# Altium project SC945D.PrjPcb (part 2 of 2)

## Sheet SC945D_SD_Card.SchDoc: SD Card
size 393 x 270 mm; CompanyName: Seccom; Address1: 521, rue du capt. François Garbit; Address2: 69440 Mornant; Address3: seccom@seccom.fr; Address4: www.seccom.fr; DocumentNumber: 5; SheetNumber: 5; SheetTotal: 9; PageSetup: Record=PageOptions|CenterHorizontal=True|CenterVertical=True|PrintScale=0.74|XCorrection=1.00|YCorrection=1.00|PrintKind=0|BorderSize=5000000|LeftOffset=0|BottomOffset=0|Orientation=2|PaperLength=1000|PaperWidth=1000|Scale=100|PaperSource=7|PrintQuality=-4|MediaType=1|DitherType=10|PaperKind=A4|PrintScaleMode=1
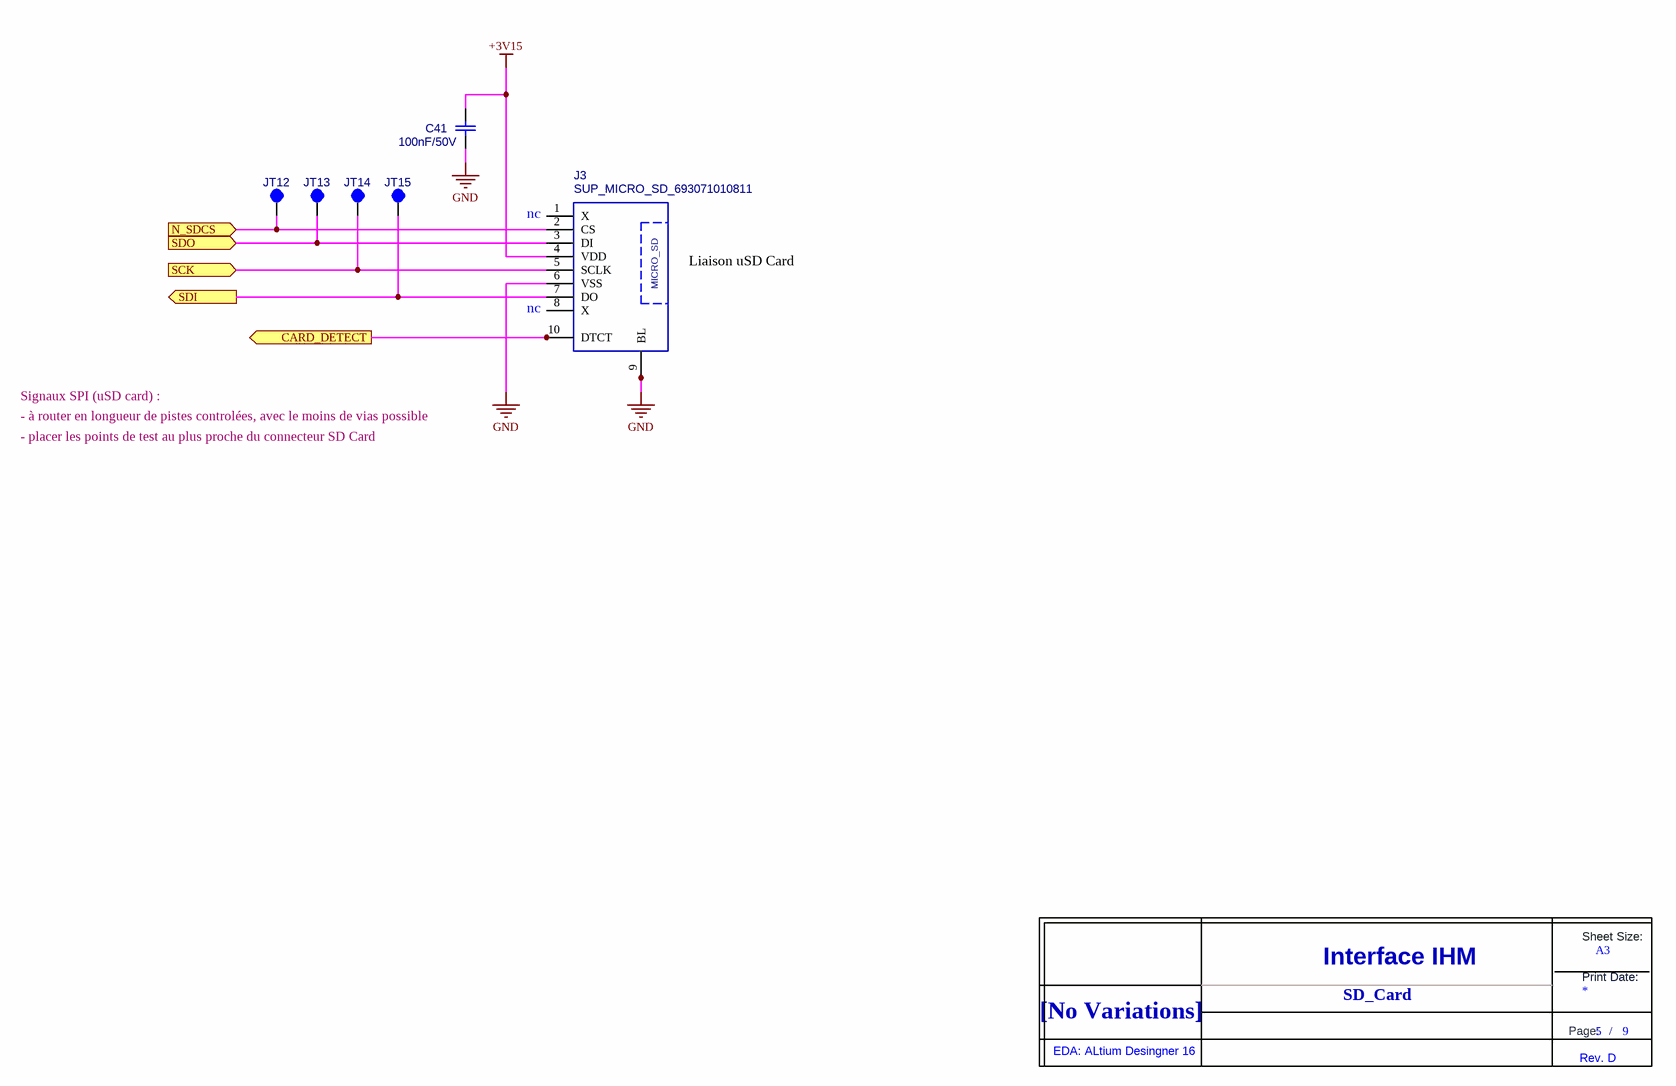
[diagram p4: SC945D_SD_Card.SchDoc]

### Parts
(Parts that share a designator on the sheet are numbered #1, #2 ... from top to bottom, then left to right.)
C41  value 100nF/50V  [0603_ReflowSoldering_CAP]  (hidden comment: C_0603_X7R_10%_100N-50V)
J3  value SUP_MICRO_SD_693071010811  [SUP_MICRO_SD_BL_PUSH-PUSH_693071010811+USD]  (hidden comment: SUP_MICRO_SD_CARD_BL_PUSH-PUSH_693071010811)
JT12  PAD_CMS_20X20_E  [PAD_CMS_20X20_E]  (value not drawn)  (no BOM)
JT13  PAD_CMS_20X20_E  [PAD_CMS_20X20_E]  (value not drawn)  (no BOM)
JT14  PAD_CMS_20X20_E  [PAD_CMS_20X20_E]  (value not drawn)  (no BOM)
JT15  PAD_CMS_20X20_E  [PAD_CMS_20X20_E]  (value not drawn)  (no BOM)
Title_new?#5  DNI  (value not drawn)  (graphical)

### Ports
CARD_DETECT (out), N_SDCS (in), SCK (in), SDI (out), SDO (in)

### Nets
+3V15: C41.2 J3.4(VDD)
GND: C41.1 J3.6(VSS) J3.9(BL) J3.9A(BL)
CARD_DETECT: J3.10(DTCT) J3.10A(DTCT) ; port CARD_DETECT
N_SDCS: J3.2(CS) JT12.1 ; port N_SDCS
SCK: J3.5(SCLK) JT14.1 ; port SCK
SDI: J3.7(DO) JT15.1 ; port SDI
SDO: J3.3(DI) JT13.1 ; port SDO

Not connected (* = marked no-connect by the designer): J3 1(X) 8(X)

### Notes on the sheet
- (near J3) nc
- (near J3) Liaison uSD Card
- - placer les points de test au plus proche du connecteur SD Card
- Signaux SPI (uSD card) :
- - à router en longueur de pistes controlées, avec le moins de vias possible
- SD_Card
- (in symbol SUP_MICRO_SD_CARD_BL_PUSH-PUSH_693071010811) MICRO_SD
- (in symbol Title_new) Sheet Size:; A3; Interface IHM; Print Date:; [No Variations]; Page:; /; EDA: ALtium Desingner 16; Rev. D

### Library data of the parts
C41 = C_0603_X7R_10%_100N-50V: as C21 on sheet SC945D_Interface_BP_et_Prog; ComponentLink1URL: O:\_Documentation\Datasheets\Kemet\Condos_Ceramic_CMS.pdf; ComponentLink2URL: o:\_Documentation\Datasheets\_BOITIERS\PASSIF_CMS\; Config: *; ComponentLink1Description: Datasheet; ComponentLink2Description: Datasheet Boitier; Supplier 1: Farnell; Supplier Part Number 1: 1288255
J3 = SUP_MICRO_SD_CARD_BL_PUSH-PUSH_693071010811: Embase pour Micro SD Card, 8 points, blindée, fixation Push-Push, noir, -25/+85°C, CMS; Creation: FB (05/03/12); Boitier: 14x15.2+1.7mm_h1.98mm; Fabricant: Wurth Elektronik; Coeff: 1; Ref Fab: 693071010811; ComponentLink2URL: o:\_Documentation\Datasheets\_BOITIERS\; Config: *; ComponentLink1URL: O:\_Documentation\Datasheets\Wurth_Elektronik\693071010811.pdf; ComponentLink1Description: Datasheet; ComponentLink2Description: Datasheet Boitier; Supplier 1: Farnell; Supplier Part Number 1: 2081363
JT12-JT15 = PAD_CMS_20X20_E: Pad en surface, CMS; Creation: LJ; Reference: {Reference}; Value: PAD CMS; Remarque: {Remarque}; Verification: LJ (03/12/02); Coeff: 0; Fabricant: {Fabricant}; Ref Fab: {Ref Fab}; Boitier: PAD_CMS_20X20_E; ComponentLink1URL: o:\_Documentation\Datasheets; ComponentLink2URL: o:\_Documentation\Datasheets\_BOITIERS\; Config: *; ComponentLink1Description: Datasheet; ComponentLink2Description: Datasheet Boitier
Title_new?#5 = Title_new

## Sheet SC945D_Audio.SchDoc: Audio
size 393 x 270 mm; CompanyName: Seccom; Address1: 521, rue du capt. François Garbit; Address2: 69440 Mornant; Address3: seccom@seccom.fr; Address4: www.seccom.fr; DocumentNumber: 6; SheetNumber: 6; SheetTotal: 9; PageSetup: Record=PageOptions|CenterHorizontal=True|CenterVertical=True|PrintScale=0.74|XCorrection=1.00|YCorrection=1.00|PrintKind=0|BorderSize=5000000|LeftOffset=0|BottomOffset=0|Orientation=2|PaperLength=1000|PaperWidth=1000|Scale=100|PaperSource=7|PrintQuality=-4|MediaType=1|DitherType=10|PaperKind=A4|PrintScaleMode=1
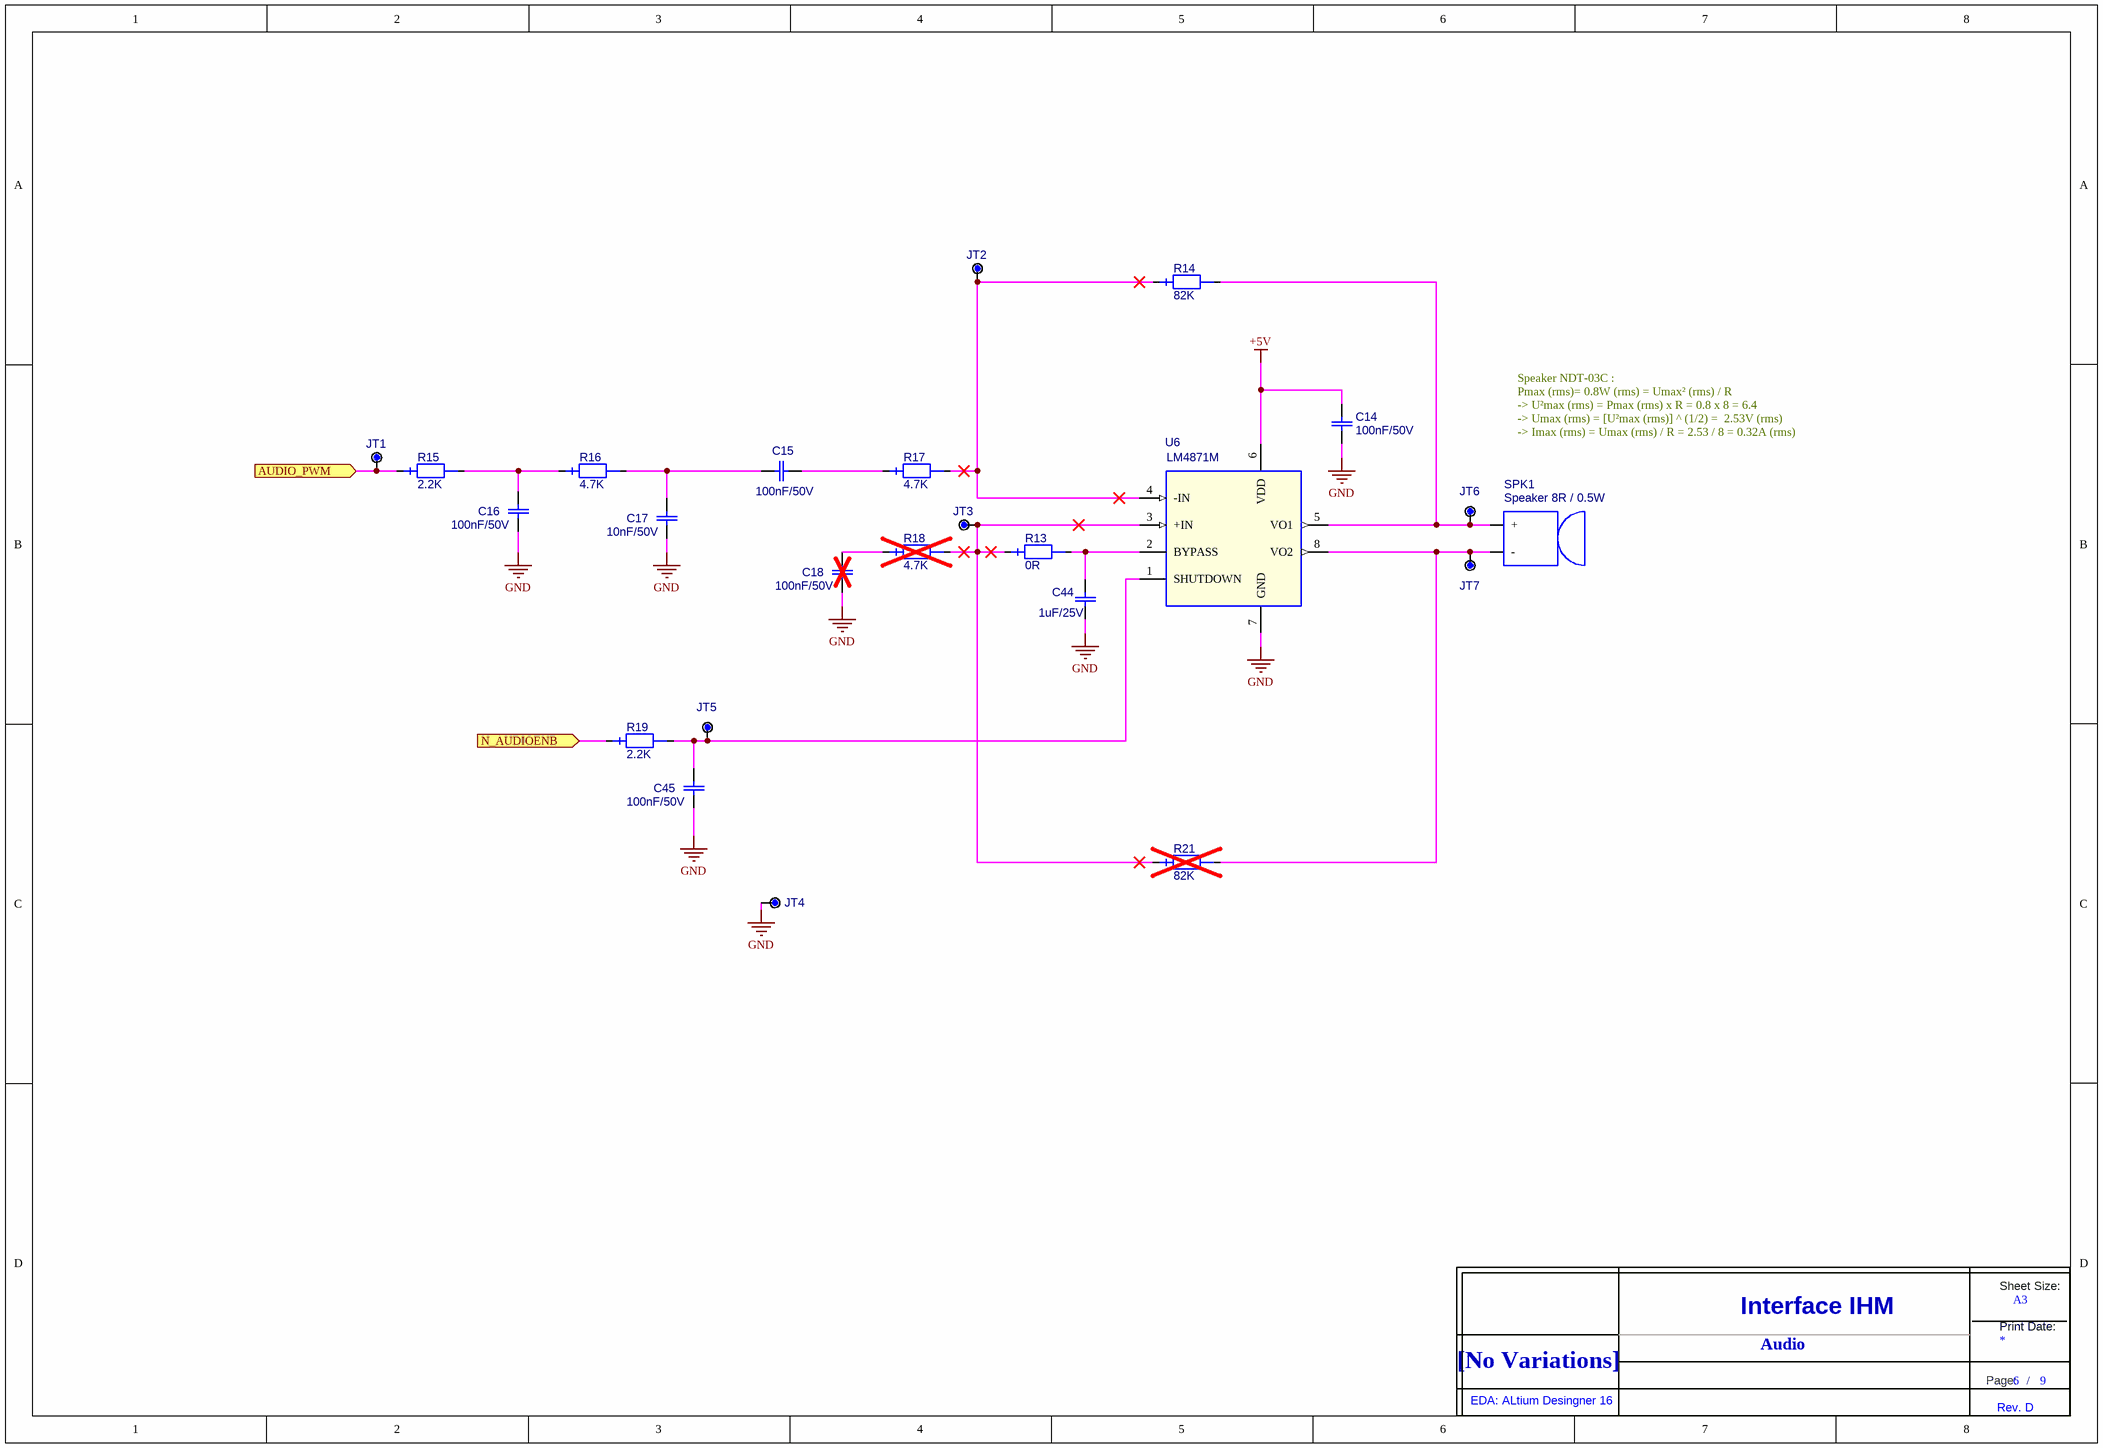
[diagram p5: SC945D_Audio.SchDoc]

### Parts
(Parts that share a designator on the sheet are numbered #1, #2 ... from top to bottom, then left to right.)
C14  value 100nF/50V  [0603_ReflowSoldering_CAP]  (hidden comment: C_0603_X7R_10%_100N-50V)
C15  value 100nF/50V  [0603_ReflowSoldering_CAP]  (hidden comment: C_0603_X7R_10%_100N-50V)
C16  value 100nF/50V  [0603_ReflowSoldering_CAP]  (hidden comment: C_0603_X7R_10%_100N-50V)
C17  value 10nF/50V  [0603_ReflowSoldering_CAP]  (hidden comment: C_0603_X7R_10%_10N-50V)
C18  value 100nF/50V  [0603_ReflowSoldering_CAP]  (hidden comment: C_0603_X7R_10%_100N-50V)  (no BOM)
C44  value 1uF/25V  [0805_ReflowSoldering_CAP]  (hidden comment: C_0805_X5R_10%_1U-25V)
C45  value 100nF/50V  [0603_ReflowSoldering_CAP]  (hidden comment: C_0603_X7R_10%_100N-50V)
JT1  POINT_TEST_PAD_40MIL  [PAD_CMS_40X40_E]  (value not drawn)  (no BOM)
JT2  POINT_TEST_PAD_40MIL  [PAD_CMS_40X40_E]  (value not drawn)  (no BOM)
JT3  POINT_TEST_PAD_40MIL  [PAD_CMS_40X40_E]  (value not drawn)  (no BOM)
JT4  POINT_TEST_PAD_40MIL  [PAD_CMS_40X40_E]  (value not drawn)  (no BOM)
JT5  POINT_TEST_PAD_40MIL  [PAD_CMS_40X40_E]  (value not drawn)  (no BOM)
JT6  POINT_TEST_PAD_40MIL  [PAD_CMS_40X40_E]  (value not drawn)  (no BOM)
JT7  POINT_TEST_PAD_40MIL  [PAD_CMS_40X40_E]  (value not drawn)  (no BOM)
R13  value 0R  [0603_ReflowSoldering_RES]  (hidden comment: RES_0603_1%_100PPM_0R)
R14  value 82K  [0603_ReflowSoldering_RES]  (hidden comment: RES_0603_1%_100PPM_82K)
R15  value 2.2K  [0603_ReflowSoldering_RES]  (hidden comment: RES_0603_1%_100PPM_2.2K)
R16  value 4.7K  [0603_ReflowSoldering_RES]  (hidden comment: RES_0603_1%_100PPM_4.7K)
R17  value 4.7K  [0603_ReflowSoldering_RES]  (hidden comment: RES_0603_1%_100PPM_4.7K)
R18  value 4.7K  [0603_ReflowSoldering_RES]  (hidden comment: RES_0603_1%_100PPM_4.7K)  (no BOM)
R19  value 2.2K  [0603_ReflowSoldering_RES]  (hidden comment: RES_0603_1%_100PPM_2.2K)
R21  value 82K  [0603_ReflowSoldering_RES]  (hidden comment: RES_0603_1%_100PPM_82K)  (no BOM)
SPK1  value Speaker 8R / 0.5W  [SPEAKER_15x15MM_NDT-03C_SMS1313-08H04LF]  (hidden comment: SPEAKER_8R_0.5W_NDT-03C)
Title_new?#6  DNI  (value not drawn)  (graphical)
U6  LM4871M  [SOIC_08_E1,27_L150_ReflowSoldering]

### Ports
AUDIO_PWM (in), N_AUDIOENB (in)

### Nets
+5V: C14.2 U6.6(VDD)
GND: C14.1 C16.1 C17.1 C18.1 C44.1 C45.1 JT4.1 U6.7(GND)
AUDIO_PWM: JT1.1 R15.1 ; port AUDIO_PWM
N_AUDIOENB: R19.1 ; port N_AUDIOENB
NetC15_1: C15.1 R17.1
NetC15_2: C15.2 C17.2 R16.2
NetC16_2: C16.2 R15.2 R16.1
NetC18_2: C18.2 R18.1
NetC44_2: C44.2 R13.2 U6.2(BYPASS)
NetC45_2: C45.2 JT5.1 R19.2 U6.1(SHUTDOWN)
NetJT2_1: JT2.1 R14.1 R17.2 U6.4(-IN)
NetJT3_1: JT3.1 R13.1 R18.2 R21.1 U6.3(+IN)
NetJT6_1: JT6.1 R14.2 SPK1.1(+) U6.5(VO1)
NetJT7_1: JT7.1 R21.2 SPK1.2(-) U6.8(VO2)

Not connected (* = marked no-connect by the designer): SPK1 FIX1 FIX2

### Notes on the sheet
- Speaker NDT-03C :
  Pmax (rms)= 0.8W (rms) = Umax² (rms) / R
  -> U²max (rms) = Pmax (rms) x R = 0.8 x 8 = 6.4
  -> Umax (rms) = [U²max (rms)] ^ (1/2) =  2.53V (rms)
  -> Imax (rms) = Umax (rms) / R = 2.53 / 8 = 0.32A (rms)
- Audio
- (in symbol Title_new) Sheet Size:; A3; Interface IHM; Print Date:; [No Variations]; Page:; /; EDA: ALtium Desingner 16; Rev. D

### Library data of the parts
C14-C16 C18 C45 = C_0603_X7R_10%_100N-50V: as C21 on sheet SC945D_Interface_BP_et_Prog; ComponentLink1URL: O:\_Documentation\Datasheets\Kemet\Condos_Ceramic_CMS.pdf; ComponentLink2URL: o:\_Documentation\Datasheets\_BOITIERS\PASSIF_CMS\; Config: *; ComponentLink1Description: Datasheet; ComponentLink2Description: Datasheet Boitier; Supplier 1: Farnell; Supplier Part Number 1: 1288255
C17 = C_0603_X7R_10%_10N-50V: Condensateur céramique, X7R, 10%, CMS 0603, 10nF/50V; Creation: FB (01/03/12); Boitier: 0603; Remarque: {Remarque}; Fabricant: Kemet; Ref Fab: C0603C103K5RAC; Coeff: 1; ComponentLink1URL: O:\_Documentation\Datasheets\Kemet\Condos_Ceramic_CMS.pdf; ComponentLink2URL: o:\_Documentation\Datasheets\_BOITIERS\PASSIF_CMS\; Config: *; ComponentLink1Description: Datasheet; ComponentLink2Description: Datasheet Boitier; Supplier 1: Farnell; Supplier 2: RadioSpares; Supplier Part Number 1: 1414609; Supplier Part Number 2: 2644595
C44 = C_0805_X5R_10%_1U-25V: Condensateur céramique, X5R, 10%, CMS 0805; Creation: FB (07/03/12); Reference: 001834/00; Boitier: 0805; Remarque: {Remarque}; Coeff: 1; Fabricant: AVX; Ref Fab: 08053D105KAT2A; Verification: *; ComponentLink1URL: O:\_Documentation\Datasheets\AVX\Condensateurs_CMS_Ceramic_X5R.pdf; ComponentLink2URL: o:\_Documentation\Datasheets\_Boitiers\PASSIF_CMS\RC_0805_(2x1,25)_(Schneider).pdf; Config: *; ComponentLink1Description: Datasheet; ComponentLink2Description: Datasheet Boitier; Supplier Part Number 1: 1327695; Supplier Part Number 2: 6983409; Supplier 1: Farnell; Supplier 2: Radiospares
JT1-JT7 = POINT_TEST_PAD_40MIL: Point de test sur CI, pad de diamètre 1.016mm (40mils); Creation: FB (04/10/12); Remarque: {Remarque}; Coeff: 1; Value: POINT_TEST; Config: *; ComponentLink1Description: Datasheet; ComponentLink2Description: Datasheet Boitier
R13 = RES_0603_1%_100PPM_0R: as R11 on sheet SC945D_Micro; Verification: *; ComponentLink1URL: O:\_Documentation\Datasheets\Vishay\Resistances_D-CRCWe3.pdf; ComponentLink2URL: o:\_Documentation\Datasheets\_BOITIERS\PASSIF_CMS\; Config: *; ComponentLink1Description: Datasheet; ComponentLink2Description: Datasheet Boitier; Supplier 1: Farnell; Supplier Part Number 1: 1469739
R14 R21 = RES_0603_1%_100PPM_82K: Résistance, 0.100W, 1%, 100ppm, 75V, 82K; Creation: FB (01/03/12); Boitier: 0603; Remarque: {Remarque}; Fabricant: Vishay; Ref Fab: CRCW060382K0FKEA; Coeff: 1; Verification: *; ComponentLink1URL: O:\_Documentation\Datasheets\Vishay\Resistances_D-CRCWe3.pdf; ComponentLink2URL: o:\_Documentation\Datasheets\_BOITIERS\PASSIF_CMS\; Config: *; ComponentLink1Description: Datasheet; ComponentLink2Description: Datasheet Boitier; Supplier 1: Farnell; Supplier 2: RadioSpares; Supplier Part Number 1: 1152140; Supplier Part Number 2: 6790737
R15 R19 = RES_0603_1%_100PPM_2.2K: Résistance, 0.100W, 1%, 100ppm, 75V, 2.2K; Creation: JPL (05/07/12); Boitier: 0603; Remarque: {Remarque}; Fabricant: Vishay; Ref Fab: CRCW06032K20FKEA; Coeff: 1; Verification: *; ComponentLink1URL: O:\_Documentation\Datasheets\Vishay\Resistances_D-CRCWe3.pdf; ComponentLink2URL: o:\_Documentation\Datasheets\_BOITIERS\PASSIF_CMS\; Config: *; ComponentLink1Description: Datasheet; ComponentLink2Description: Datasheet Boitier; Supplier 1: Farnell; Supplier 2: RadioSpares; Supplier Part Number 1: 1469765; Supplier Part Number 2: 6790112
R16-R18 = RES_0603_1%_100PPM_4.7K: Résistance, 0.100W, 1%, 100ppm, 75V, 4.7K; Creation: JPL (05/07/12); Boitier: 0603; Remarque: {Remarque}; Fabricant: Vishay; Ref Fab: CRCW06034K70FKEA; Coeff: 1; Verification: *; ComponentLink1URL: O:\_Documentation\Datasheets\Vishay\Resistances_D-CRCWe3.pdf; ComponentLink2URL: o:\_Documentation\Datasheets\_BOITIERS\PASSIF_CMS\; Config: *; ComponentLink1Description: Datasheet; ComponentLink2Description: Datasheet Boitier; Supplier 1: Farnell; Supplier 2: RadioSpares; Supplier Part Number 1: 1469807; Supplier Part Number 2: 6790484
SPK1 = SPEAKER_8R_0.5W_NDT-03C: Speaker dynamique, impedance 8R, Pnom=0.5W, Pmax=0.8W, Fres=800Hz, 90dBA, -30/+85°C, CMS; Creation: FB (29/02/12); Boitier: 15x15x4mm; Remarque: {Remarque}; Fabricant: Star-Micronics; Coeff: 1; Ref Fab: NDT-03C; ComponentLink1URL: O:\_Documentation\Datasheets\Star_Micronics\NDT-03C_Datasheet.pdf; ComponentLink2URL: O:\_Documentation\Datasheets\Star_Micronics\NDT-03C_Footprint.pdf; Config: *; ComponentLink1Description: Datasheet; ComponentLink2Description: Datasheet Boitier; Supplier 1: Farnell; Supplier Part Number 1: 1299760
Title_new?#6 = Title_new
U6 = LM4871M: Amplificateur audio avec shutdown, 1.5W/8ohm, Vdd=2~5.5V, -40/+125°C, CMS; Creation: PDP (11/07/12); Verification: FB (11/09/12); Boitier: SOIC 8; Remarque: {Remarque}; Coeff: 1; Fabricant: National Semiconductor; Ref Fab: LM4871M/NOPB; ComponentLink1URL: o:\_Documentation\Datasheets\National_SemiConductors\LM4871.pdf; ComponentLink2URL: o:\_Documentation\Datasheets\_Boitiers\ACTIF_CMS\; ComponentLink1Description: Datasheet; ComponentLink2Description: Datasheet Boitier; Supplier 1: Farnell; Supplier Part Number 1: 1468873; Supplier 2: Mouser; Supplier Part Number 2: 926-LM4871M/NOPB; Value: LM4871M

## Sheet SC945D_Touchscreen.SchDoc: Touchscreen
size 393 x 270 mm; CompanyName: Seccom; Address1: 521, rue du capt. François Garbit; Address2: 69440 Mornant; Address3: seccom@seccom.fr; Address4: www.seccom.fr; DocumentNumber: 7; SheetNumber: 7; SheetTotal: 9; PageSetup: Record=PageOptions|CenterHorizontal=True|CenterVertical=True|PrintScale=0.74|XCorrection=1.00|YCorrection=1.00|PrintKind=0|BorderSize=5000000|LeftOffset=0|BottomOffset=0|Orientation=2|PaperLength=1000|PaperWidth=1000|Scale=100|PaperSource=7|PrintQuality=-4|MediaType=1|DitherType=10|PaperKind=A4|PrintScaleMode=1
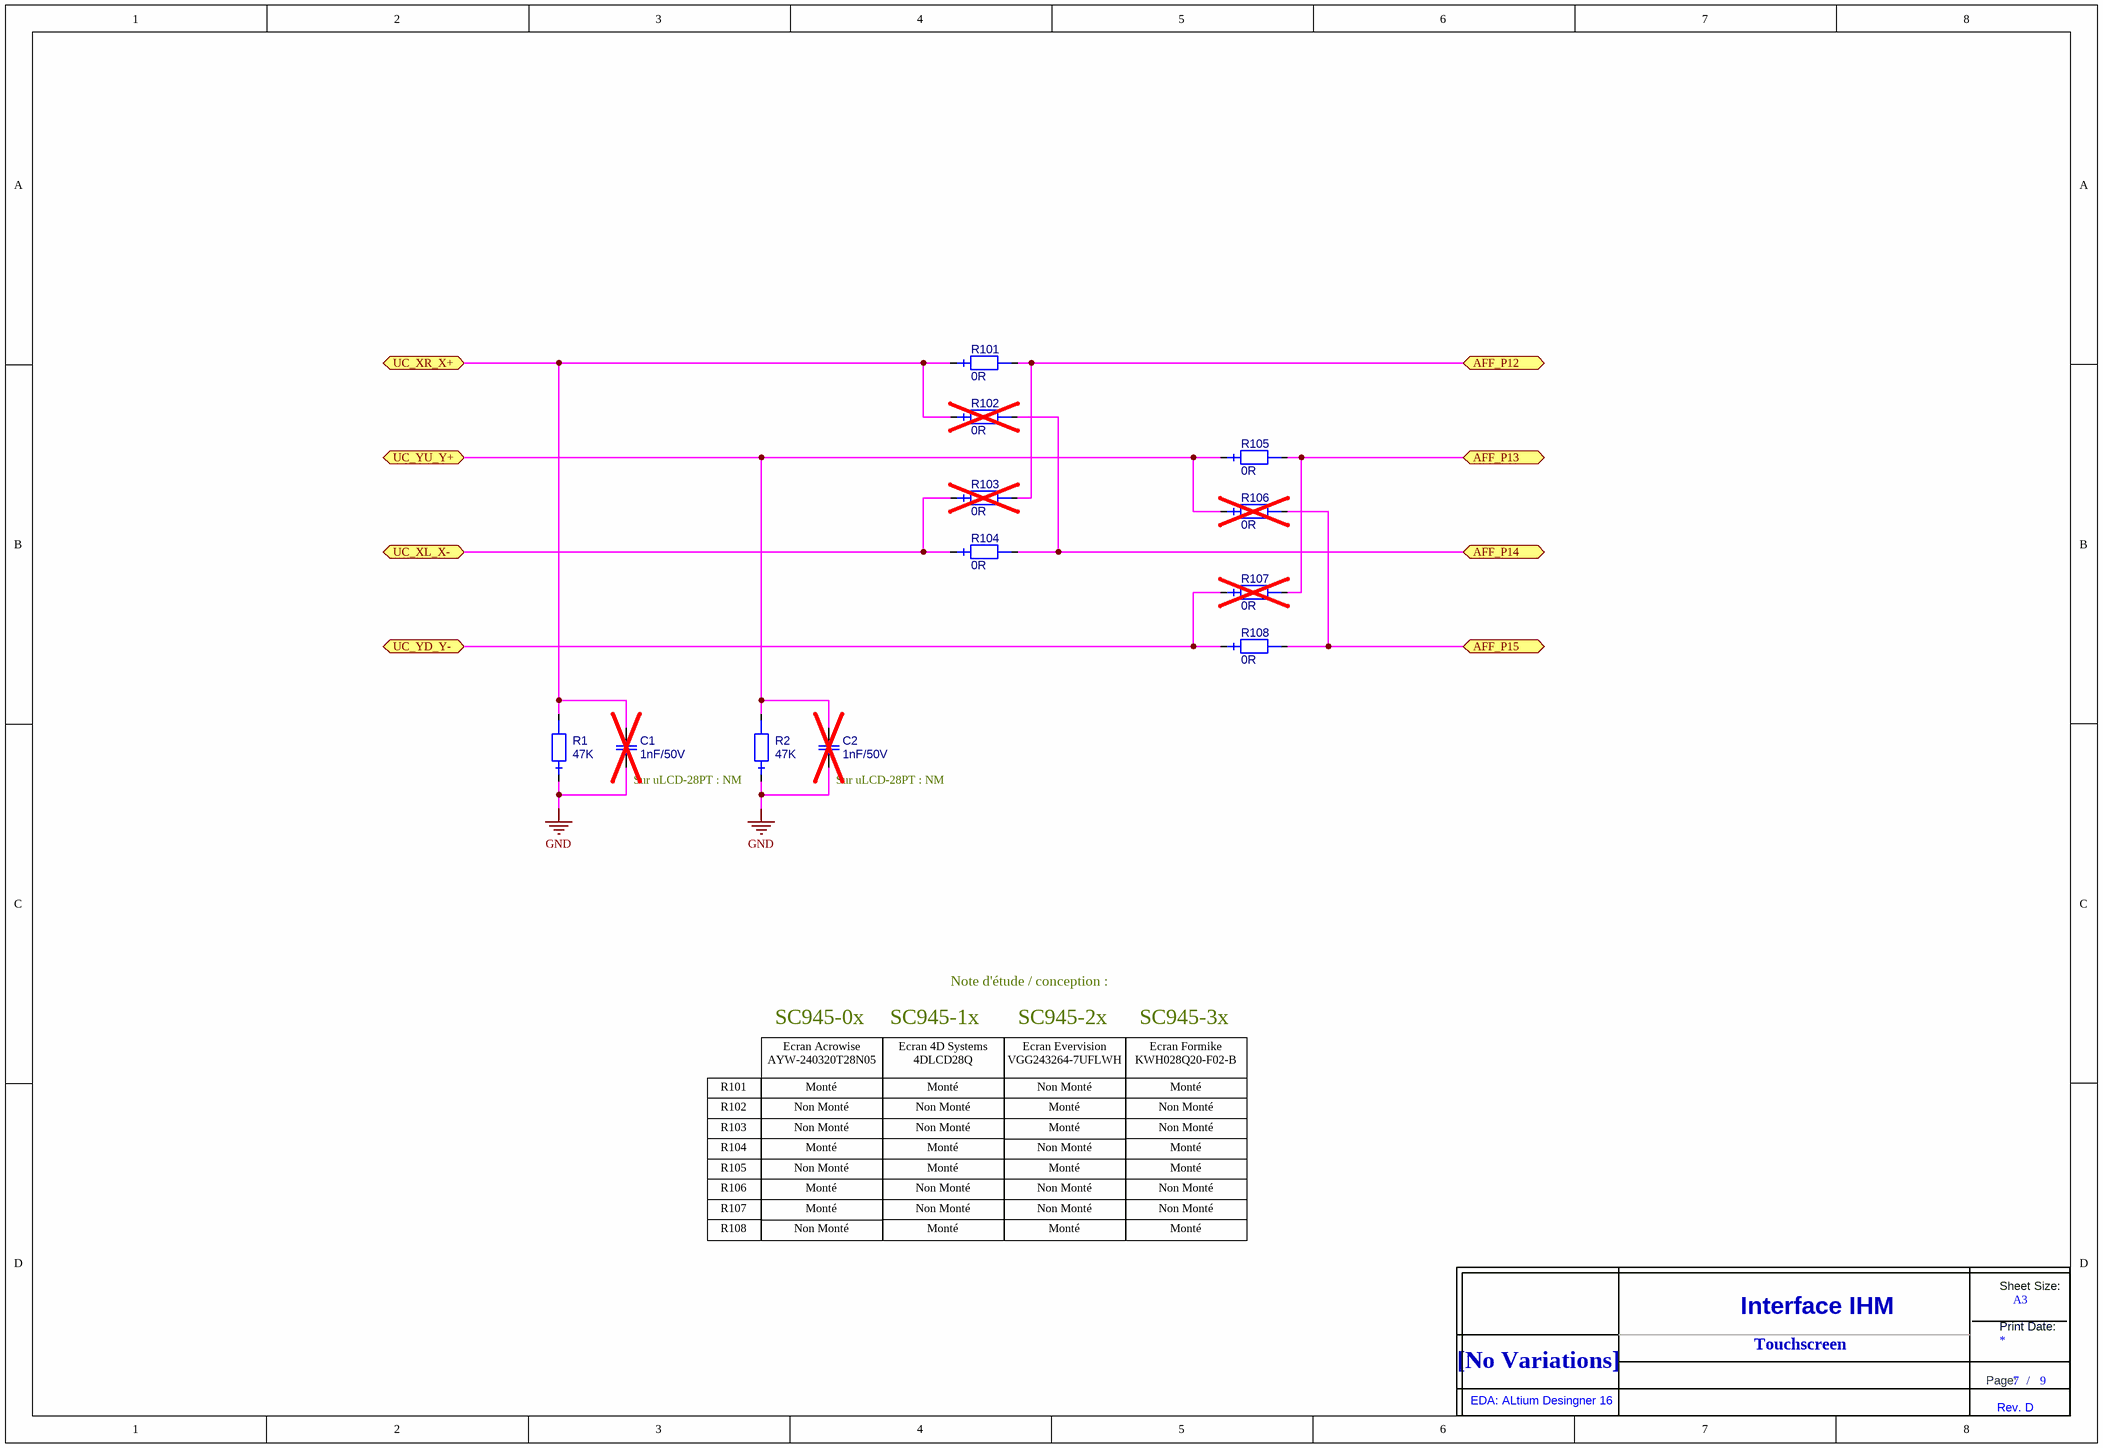
[diagram p6: SC945D_Touchscreen.SchDoc]

### Parts
(Parts that share a designator on the sheet are numbered #1, #2 ... from top to bottom, then left to right.)
C1  value 1nF/50V  [0603_ReflowSoldering_CAP]  (hidden comment: C_0603_NPO_5%_1N-50V)  (no BOM)
C2  value 1nF/50V  [0603_ReflowSoldering_CAP]  (hidden comment: C_0603_NPO_5%_1N-50V)  (no BOM)
R1  value 47K  [0603_ReflowSoldering_RES]  (hidden comment: RES_0603_1%_100PPM_47K)
R2  value 47K  [0603_ReflowSoldering_RES]  (hidden comment: RES_0603_1%_100PPM_47K)
R101  value 0R  [0603_ReflowSoldering_RES]  (hidden comment: RES_0603_1%_100PPM_0R)
R102  value 0R  [0603_ReflowSoldering_RES]  (hidden comment: RES_0603_1%_100PPM_0R)  (no BOM)
R103  value 0R  [0603_ReflowSoldering_RES]  (hidden comment: RES_0603_1%_100PPM_0R)  (no BOM)
R104  value 0R  [0603_ReflowSoldering_RES]  (hidden comment: RES_0603_1%_100PPM_0R)
R105  value 0R  [0603_ReflowSoldering_RES]  (hidden comment: RES_0603_1%_100PPM_0R)
R106  value 0R  [0603_ReflowSoldering_RES]  (hidden comment: RES_0603_1%_100PPM_0R)  (no BOM)
R107  value 0R  [0603_ReflowSoldering_RES]  (hidden comment: RES_0603_1%_100PPM_0R)  (no BOM)
R108  value 0R  [0603_ReflowSoldering_RES]  (hidden comment: RES_0603_1%_100PPM_0R)
Title_new?#7  DNI  (value not drawn)  (graphical)

### Ports
AFF_P12 (bidir), AFF_P13 (bidir), AFF_P14 (bidir), AFF_P15 (bidir), UC_XL_X- (bidir), UC_XR_X+ (bidir), UC_YD_Y- (bidir), UC_YU_Y+ (bidir)

### Nets
GND: C1.1 C2.1 R1.1 R2.1
AFF_P12: R101.2 R103.2 ; port AFF_P12
AFF_P13: R105.2 R107.2 ; port AFF_P13
AFF_P14: R102.2 R104.2 ; port AFF_P14
AFF_P15: R106.2 R108.2 ; port AFF_P15
UC_XL_X-: R103.1 R104.1 ; port UC_XL_X-
UC_XR_X+: C1.2 R1.2 R101.1 R102.1 ; port UC_XR_X+
UC_YD_Y-: R107.1 R108.1 ; port UC_YD_Y-
UC_YU_Y+: C2.2 R2.2 R105.1 R106.1 ; port UC_YU_Y+

### Notes on the sheet
- Sur uLCD-28PT : NM
- (near C2) Sur uLCD-28PT : NM
- Note d'étude / conception :
- SC945-0x
- SC945-1x
- SC945-2x
- SC945-3x
- R101
- R102
- Ecran Acrowise
  AYW-240320T28N05
- Monté
- Non Monté
- Ecran 4D Systems
  4DLCD28Q
- Ecran Evervision
  VGG243264-7UFLWH
- Ecran Formike
  KWH028Q20-F02-B
- R103
- R104
- R105
- R106
- R107
- R108
- Touchscreen
- (in symbol Title_new) Sheet Size:; A3; Interface IHM; Print Date:; [No Variations]; Page:; /; EDA: ALtium Desingner 16; Rev. D

### Library data of the parts
C1 C2 = C_0603_NPO_5%_1N-50V: Condensateur céramique, NPO, 5%, CMS 0603; Creation: LJ; Reference: 001809/00; Boitier: 0603; Remarque: {Remarque}; Coeff: 1; Fabricant: AVX; Ref Fab: 06035A102JAT2A; ComponentLink1URL: o:\_Documentation\Datasheets\BC_Components\Condo_CMS_NPO-X7R-Y5V.pdf; ComponentLink2URL: o:\_Documentation\Datasheets\_BOITIERS\PASSIF_CMS\; Config: *; ComponentLink1Description: Datasheet; ComponentLink2Description: Datasheet Boitier; Supplier 1: Mouser; Supplier Part Number 1: 581-06035A102J
R1 R2 = RES_0603_1%_100PPM_47K: Résistance, 0.100W, 1%, 100ppm, 75V, 47K; Creation: JPL (05/07/12); Boitier: 0603; Remarque: {Remarque}; Fabricant: Vishay; Ref Fab: CRCW060347K0FKEA; Coeff: 1; Verification: *; ComponentLink1URL: O:\_Documentation\Datasheets\Vishay\Resistances_D-CRCWe3.pdf; ComponentLink2URL: o:\_Documentation\Datasheets\_BOITIERS\PASSIF_CMS\; Config: *; ComponentLink1Description: Datasheet; ComponentLink2Description: Datasheet Boitier; Supplier 1: Farnell; Supplier 2: RadioSpares; Supplier Part Number 1: 1469811; Supplier Part Number 2: 6790425
R101-R108 = RES_0603_1%_100PPM_0R: as R11 on sheet SC945D_Micro; Verification: *; ComponentLink1URL: O:\_Documentation\Datasheets\Vishay\Resistances_D-CRCWe3.pdf; ComponentLink2URL: o:\_Documentation\Datasheets\_BOITIERS\PASSIF_CMS\; Config: *; ComponentLink1Description: Datasheet; ComponentLink2Description: Datasheet Boitier; Supplier 1: Farnell; Supplier Part Number 1: 1469739
Title_new?#7 = Title_new

## Sheet SC945D_Backlight.SchDoc: Backlight
size 393 x 270 mm; CompanyName: Seccom; Address1: 521, rue du capt. François Garbit; Address2: 69440 Mornant; Address3: seccom@seccom.fr; Address4: www.seccom.fr; DocumentNumber: 8; SheetNumber: 8; SheetTotal: 9; PageSetup: Record=PageOptions|CenterHorizontal=True|CenterVertical=True|PrintScale=0.74|XCorrection=1.00|YCorrection=1.00|PrintKind=0|BorderSize=5000000|LeftOffset=0|BottomOffset=0|Orientation=2|PaperLength=1000|PaperWidth=1000|Scale=100|PaperSource=7|PrintQuality=-4|MediaType=1|DitherType=10|PaperKind=A4|PrintScaleMode=1
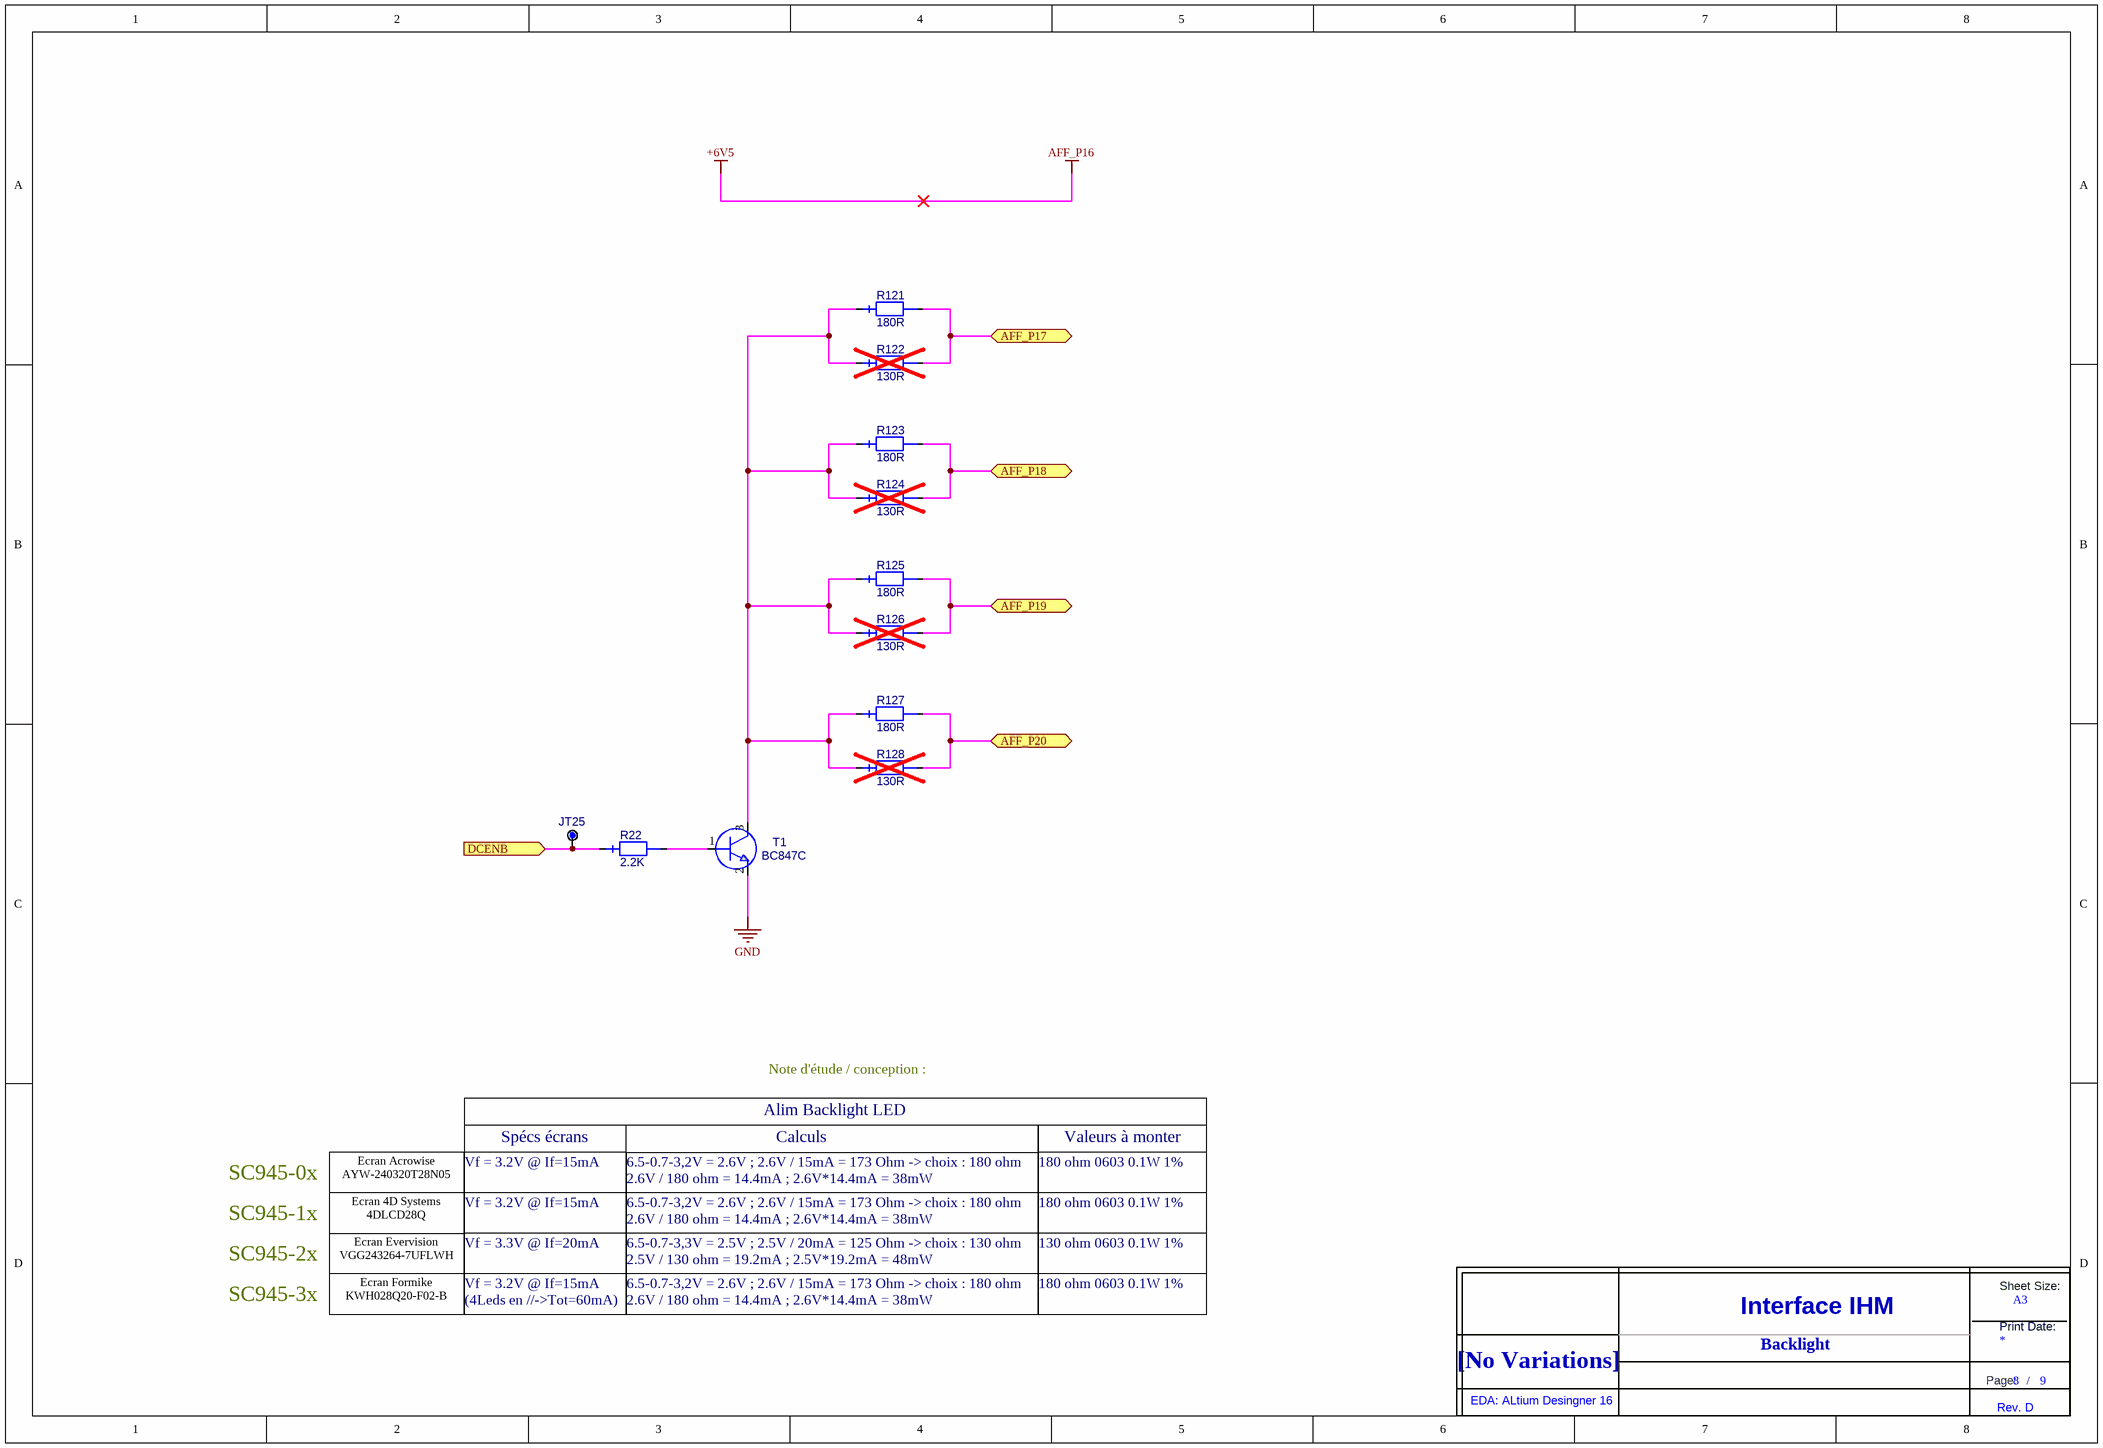
[diagram p7: SC945D_Backlight.SchDoc]

### Parts
(Parts that share a designator on the sheet are numbered #1, #2 ... from top to bottom, then left to right.)
JT25  POINT_TEST_PAD_40MIL  [PAD_CMS_40X40_E]  (value not drawn)  (no BOM)
R22  value 2.2K  [0603_ReflowSoldering_RES]  (hidden comment: RES_0603_1%_100PPM_2.2K)
R121  value 180R  [0603_ReflowSoldering_RES]  (hidden comment: RES_0603_1%_100PPM_180R)
R122  value 130R  [0603_ReflowSoldering_RES]  (hidden comment: RES_0603_1%_100PPM_130R)  (no BOM)
R123  value 180R  [0603_ReflowSoldering_RES]  (hidden comment: RES_0603_1%_100PPM_180R)
R124  value 130R  [0603_ReflowSoldering_RES]  (hidden comment: RES_0603_1%_100PPM_130R)  (no BOM)
R125  value 180R  [0603_ReflowSoldering_RES]  (hidden comment: RES_0603_1%_100PPM_180R)
R126  value 130R  [0603_ReflowSoldering_RES]  (hidden comment: RES_0603_1%_100PPM_130R)  (no BOM)
R127  value 180R  [0603_ReflowSoldering_RES]  (hidden comment: RES_0603_1%_100PPM_180R)
R128  value 130R  [0603_ReflowSoldering_RES]  (hidden comment: RES_0603_1%_100PPM_130R)  (no BOM)
T1  BC847C  [SOT23_3L_ReflowSoldering]
Title_new?#8  DNI  (value not drawn)  (graphical)

### Ports
AFF_P17 (bidir), AFF_P18 (bidir), AFF_P19 (bidir), AFF_P20 (bidir), DCENB (in)

### Nets
GND: T1.2(E)
AFF_P17: R121.2 R122.2 ; port AFF_P17
AFF_P18: R123.2 R124.2 ; port AFF_P18
AFF_P19: R125.2 R126.2 ; port AFF_P19
AFF_P20: R127.2 R128.2 ; port AFF_P20
DCENB: JT25.1 R22.1 ; port DCENB
NetR22_2: R22.2 T1.1(B)
NetR121_1: R121.1 R122.1 R123.1 R124.1 R125.1 R126.1 R127.1 R128.1 T1.3(C)

### Notes on the sheet
- Alim Backlight LED
- Note d'étude / conception :
- SC945-0x
- Ecran Acrowise
  AYW-240320T28N05
- Spécs écrans
- Vf = 3.2V @ If=15mA
- Calculs
- 6.5-0.7-3,2V = 2.6V ; 2.6V / 15mA = 173 Ohm -> choix : 180 ohm
  2.6V / 180 ohm = 14.4mA ; 2.6V*14.4mA = 38mW
- Valeurs à monter
- 180 ohm 0603 0.1W 1%
- SC945-1x
- SC945-2x
- Ecran 4D Systems
  4DLCD28Q
- SC945-3x
- Ecran Evervision
  VGG243264-7UFLWH
- Ecran Formike
  KWH028Q20-F02-B
- Vf = 3.3V @ If=20mA
- Vf = 3.2V @ If=15mA
  (4Leds en //->Tot=60mA)
- 6.5-0.7-3,3V = 2.5V ; 2.5V / 20mA = 125 Ohm -> choix : 130 ohm
  2.5V / 130 ohm = 19.2mA ; 2.5V*19.2mA = 48mW
- 130 ohm 0603 0.1W 1%
- Backlight
- (in symbol Title_new) Sheet Size:; A3; Interface IHM; Print Date:; [No Variations]; Page:; /; EDA: ALtium Desingner 16; Rev. D

### Library data of the parts
JT25 = POINT_TEST_PAD_40MIL: as JT1 on sheet SC945D_Audio; Value: POINT_TEST; Config: *; ComponentLink1Description: Datasheet; ComponentLink2Description: Datasheet Boitier
R22 = RES_0603_1%_100PPM_2.2K: as R15 on sheet SC945D_Audio; Verification: *; ComponentLink1URL: O:\_Documentation\Datasheets\Vishay\Resistances_D-CRCWe3.pdf; ComponentLink2URL: o:\_Documentation\Datasheets\_BOITIERS\PASSIF_CMS\; Config: *; ComponentLink1Description: Datasheet; ComponentLink2Description: Datasheet Boitier; Supplier 1: Farnell; Supplier 2: RadioSpares; Supplier Part Number 1: 1469765; Supplier Part Number 2: 6790112
R121 R123 R125 R127 = RES_0603_1%_100PPM_180R: Résistance, 0.100W, 1%, 100ppm, 75V, 180R; Creation: FB (06/09/12); Boitier: 0603; Remarque: {Remarque}; Fabricant: Vishay; Ref Fab: CRCW0603180RFKEA; Coeff: 1; Verification: *; ComponentLink1URL: O:\_Documentation\Datasheets\Vishay\Resistances_D-CRCWe3.pdf; ComponentLink2URL: o:\_Documentation\Datasheets\_BOITIERS\PASSIF_CMS\; Config: *; ComponentLink1Description: Datasheet; ComponentLink2Description: Datasheet Boitier; Supplier 1: Farnell; Supplier Part Number 1: 1469762; Supplier 2: Mouser; Supplier Part Number 2: 71-CRCW0603-180-E3
R122 R124 R126 R128 = RES_0603_1%_100PPM_130R: Résistance, 0.100W, 1%, 100ppm, 75V, 130R; Creation: FB (10/09/12); Boitier: 0603; Remarque: {Remarque}; Fabricant: Vishay; Ref Fab: CRCW0603130RFKEA; Coeff: 1; Verification: *; ComponentLink1URL: O:\_Documentation\Datasheets\Vishay\Resistances_D-CRCWe3.pdf; ComponentLink2URL: o:\_Documentation\Datasheets\_BOITIERS\PASSIF_CMS\; Config: *; ComponentLink1Description: Datasheet; ComponentLink2Description: Datasheet Boitier; Supplier 1: Farnell; Supplier Part Number 1: 2141288; Supplier 2: Mouser; Supplier Part Number 2: 71-CRCW0603-130-E3
T1 = BC847C: Transistor NPN, Vce=50V, Ic=0.1A, hfe=420~800, 0.25W, CMS; Creation: GO (08/07/05); Verification: LJ (21/07/05); Reference: 000329/00; Boitier: SOT23_3L; Remarque: Complementaires aux BC856-860; Coeff: 1; Fabricant: NXP; ComponentLink1URL: O:\_Documentation\Datasheets\NXP\BC847.pdf; ComponentLink2URL: o:\_Documentation\Datasheets\_BOITIERS\ACTIF_CMS\SOT\SOT_23_3P_(Schneider).PDF; Config: *; ComponentLink1Description: Datasheet; Value: BC847C; Supplier 1: Farnell; Supplier Part Number 1: 1081235; Ref Fab: BC847C; ComponentLink2Description: Datasheet Boitier
Title_new?#8 = Title_new

## Sheet SC945D_Afficheur.SchDoc: Afficheur
size 393 x 270 mm; CompanyName: Seccom; Address1: 521, rue du capt. François Garbit; Address2: 69440 Mornant; Address3: seccom@seccom.fr; Address4: www.seccom.fr; DocumentNumber: 9; SheetNumber: 9; SheetTotal: 9; PageSetup: Record=PageOptions|CenterHorizontal=True|CenterVertical=True|PrintScale=0.74|XCorrection=1.00|YCorrection=1.00|PrintKind=0|BorderSize=5000000|LeftOffset=0|BottomOffset=0|Orientation=2|PaperLength=1000|PaperWidth=1000|Scale=100|PaperSource=7|PrintQuality=-4|MediaType=1|DitherType=10|PaperKind=A4|PrintScaleMode=1
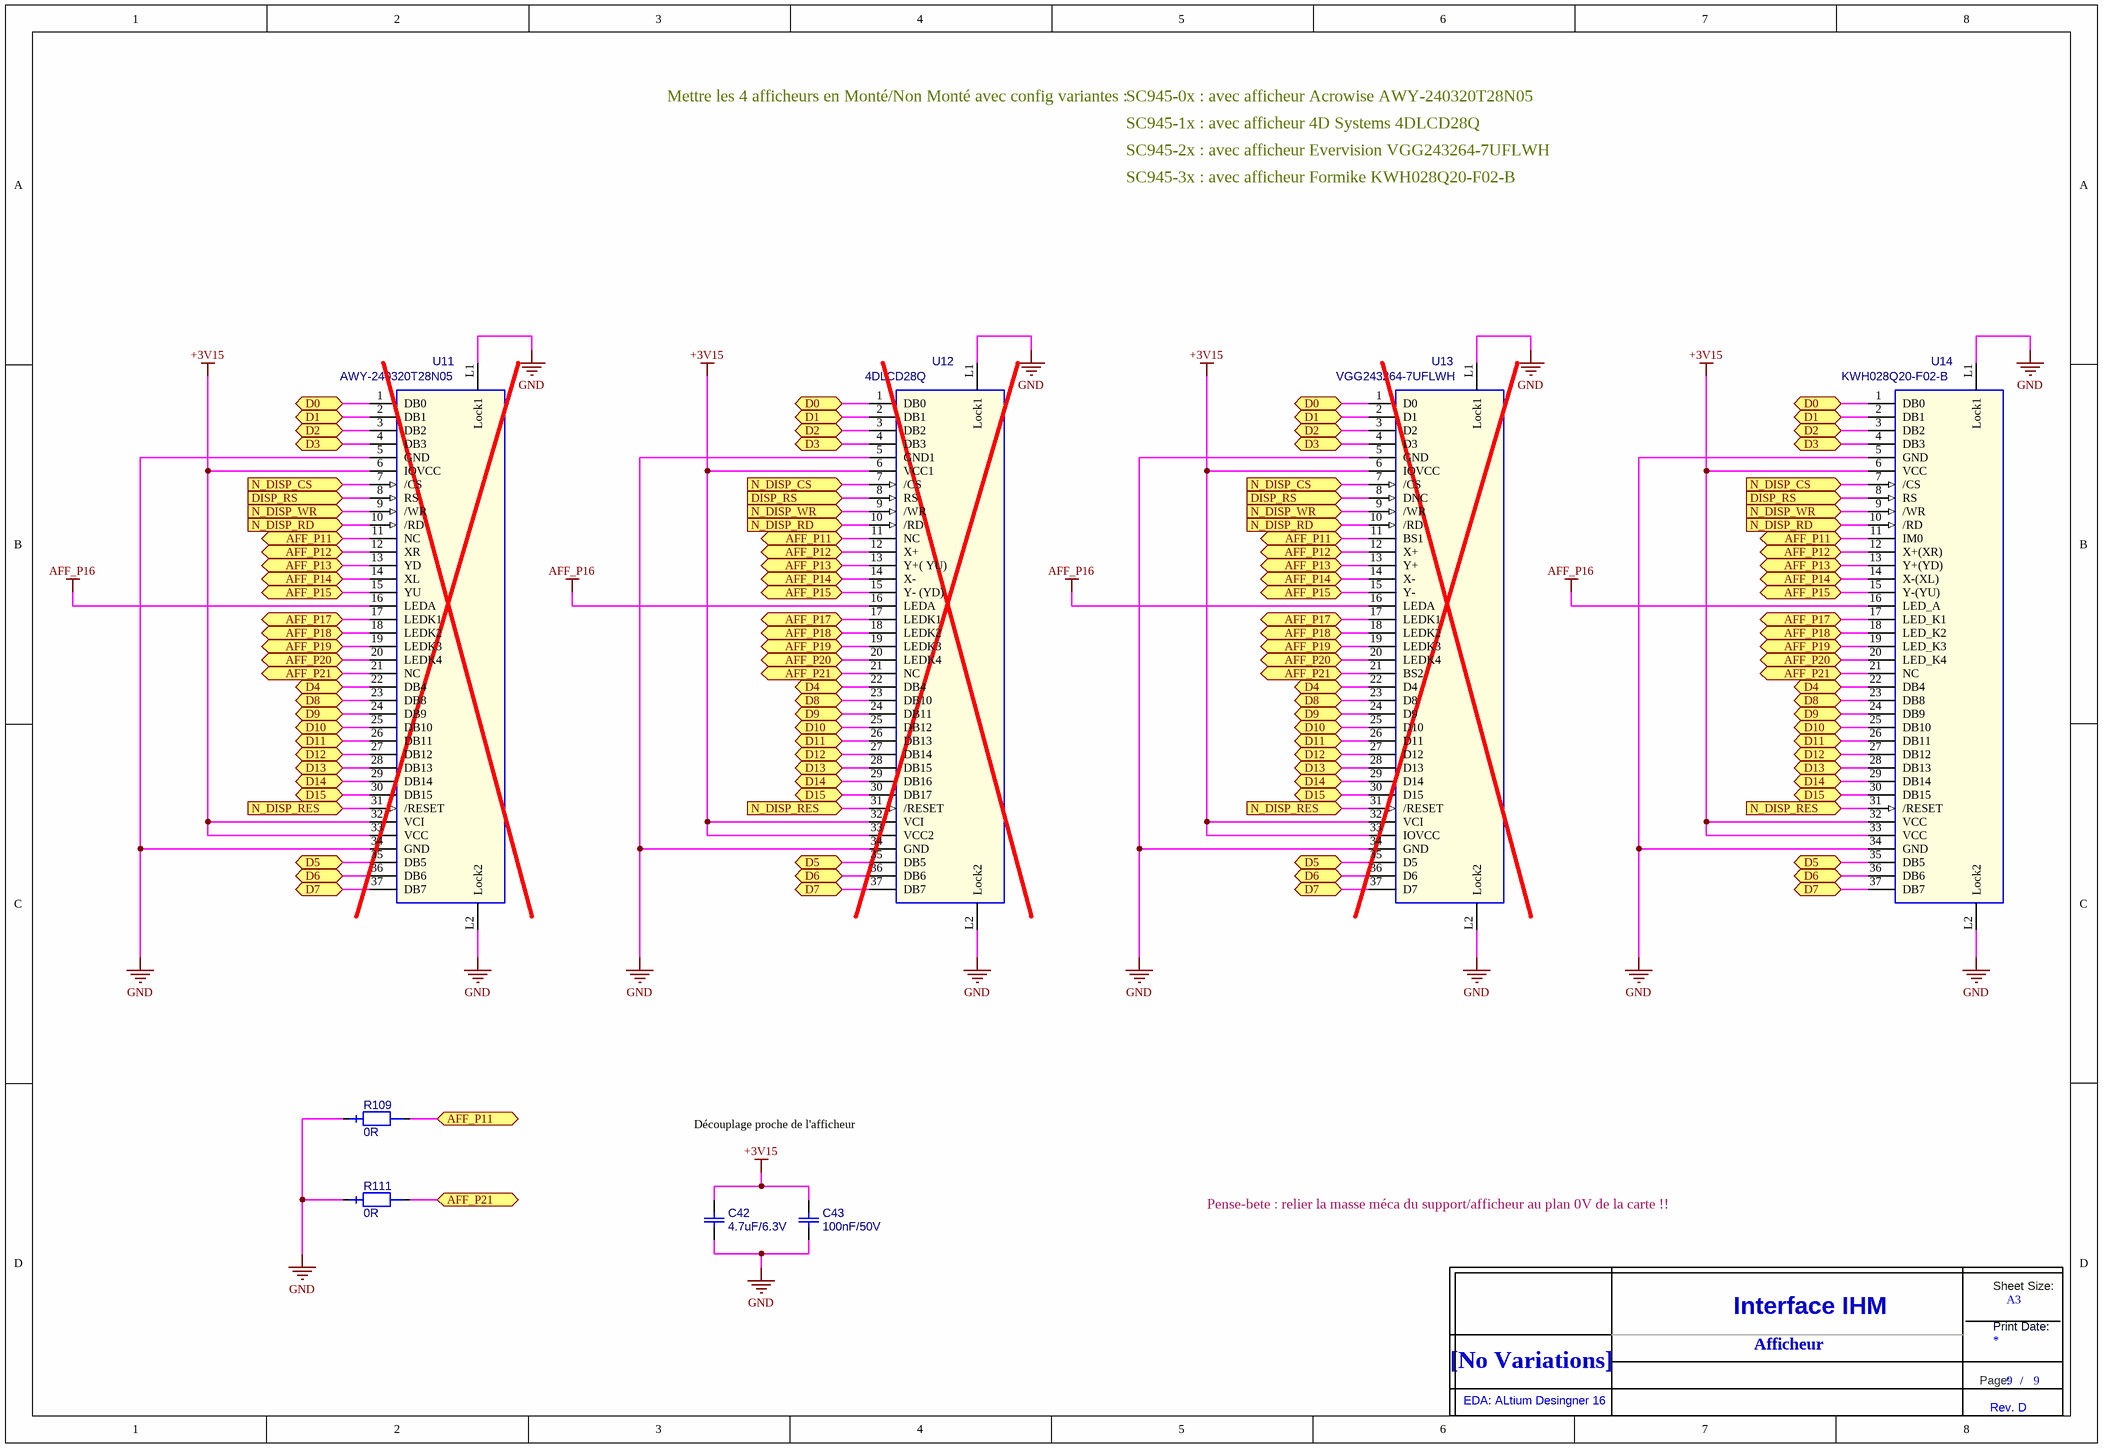
[diagram p8: SC945D_Afficheur.SchDoc]

### Parts
(Parts that share a designator on the sheet are numbered #1, #2 ... from top to bottom, then left to right.)
C42  value 4.7uF/6.3V  [0603_ReflowSoldering_CAP]  (hidden comment: C_0603_X5R_10%_4.7U-6.3V)
C43  value 100nF/50V  [0603_ReflowSoldering_CAP]  (hidden comment: C_0603_X7R_10%_100N-50V)
R109  value 0R  [0603_ReflowSoldering_RES]  (hidden comment: RES_0603_1%_100PPM_0R)
R111  value 0R  [0603_ReflowSoldering_RES]  (hidden comment: RES_0603_1%_100PPM_0R)
Title_new?#9  DNI  (value not drawn)  (graphical)
U11  value AWY-240320T28N05  [AFFICHEUR_50x69.2_FPC37_e1MM]  (hidden comment: AFFICHEUR_AWY-240320T28N05)  (no BOM)
U12  value 4DLCD28Q  [AFFICHEUR_50x69.2_FPC37_e1MM]  (hidden comment: AFFICHEUR_4DLCD28Q)  (no BOM)
U13  value VGG243264-7UFLWH  [AFFICHEUR_50x69.2_FPC37_e1MM]  (hidden comment: AFFICHEUR_VGG243264-7UFLWH)  (no BOM)
U14  value KWH028Q20-F02-B  [AFFICHEUR_50x69.2_FPC37_e1MM]  (hidden comment: AFFICHEUR_KWH028Q20_F02_B)

### Ports
AFF_P11 (bidir), AFF_P12 (bidir), AFF_P13 (bidir), AFF_P14 (bidir), AFF_P15 (bidir), AFF_P17 (bidir), AFF_P18 (bidir), AFF_P19 (bidir), AFF_P20 (bidir), AFF_P21 (bidir), D0 (bidir), D1 (bidir), D2 (bidir), D3 (bidir), D4 (bidir), D5 (bidir), D6 (bidir), D7 (bidir), D8 (bidir), D9 (bidir), D10 (bidir), D11 (bidir), D12 (bidir), D13 (bidir), D14 (bidir), D15 (bidir), DISP_RS (in), N_DISP_CS (in), N_DISP_RD (in), N_DISP_RES (in), N_DISP_WR (in)

### Nets
+3V15: C42.2 C43.2 U11.6(IOVCC) U11.32(VCI) U11.33(VCC) U12.6(VCC1) U12.32(VCI) U12.33(VCC2) U13.6(IOVCC) U13.32(VCI) U13.33(IOVCC) U14.6(VCC) U14.32(VCC) U14.33(VCC)
AFF_P16: U11.16(LEDA) U12.16(LEDA) U13.16(LEDA) U14.16(LED_A)  [project net +6V5]
GND: C42.1 C43.1 R109.1 R111.1 U11.5(GND) U11.34(GND) U11.L1(Lock1) U11.L2(Lock2) U12.5(GND1) U12.34(GND) U12.L1(Lock1) U12.L2(Lock2) U13.5(GND) U13.34(GND) U13.L1(Lock1) U13.L2(Lock2) U14.5(GND) U14.34(GND) U14.L1(Lock1) U14.L2(Lock2)
AFF_P11: R109.2 U11.11(NC) U12.11(NC) U13.11(BS1) U14.11(IM0) ; port AFF_P11
AFF_P12: U11.12(XR) U12.12(X+) U13.12(X+) U14.12(X+(XR)) ; port AFF_P12
AFF_P13: U11.13(YD) U12.13(Y+(_YU)) U13.13(Y+) U14.13(Y+(YD)) ; port AFF_P13
AFF_P14: U11.14(XL) U12.14(X-) U13.14(X-) U14.14(X-(XL)) ; port AFF_P14
AFF_P15: U11.15(YU) U12.15(Y-_(YD)) U13.15(Y-) U14.15(Y-(YU)) ; port AFF_P15
AFF_P17: U11.17(LEDK1) U12.17(LEDK1) U13.17(LEDK1) U14.17(LED_K1) ; port AFF_P17
AFF_P18: U11.18(LEDK2) U12.18(LEDK2) U13.18(LEDK2) U14.18(LED_K2) ; port AFF_P18
AFF_P19: U11.19(LEDK3) U12.19(LEDK3) U13.19(LEDK3) U14.19(LED_K3) ; port AFF_P19
AFF_P20: U11.20(LEDK4) U12.20(LEDK4) U13.20(LEDK4) U14.20(LED_K4) ; port AFF_P20
AFF_P21: R111.2 U11.21(NC) U12.21(NC) U13.21(BS2) U14.21(NC) ; port AFF_P21
D0: U11.1(DB0) U12.1(DB0) U13.1(D0) U14.1(DB0) ; port D0
D1: U11.2(DB1) U12.2(DB1) U13.2(D1) U14.2(DB1) ; port D1
D2: U11.3(DB2) U12.3(DB2) U13.3(D2) U14.3(DB2) ; port D2
D3: U11.4(DB3) U12.4(DB3) U13.4(D3) U14.4(DB3) ; port D3
D4: U11.22(DB4) U12.22(DB4) U13.22(D4) U14.22(DB4) ; port D4
D5: U11.35(DB5) U12.35(DB5) U13.35(D5) U14.35(DB5) ; port D5
D6: U11.36(DB6) U12.36(DB6) U13.36(D6) U14.36(DB6) ; port D6
D7: U11.37(DB7) U12.37(DB7) U13.37(D7) U14.37(DB7) ; port D7
D8: U11.23(DB8) U12.23(DB10) U13.23(D8) U14.23(DB8) ; port D8
D9: U11.24(DB9) U12.24(DB11) U13.24(D9) U14.24(DB9) ; port D9
D10: U11.25(DB10) U12.25(DB12) U13.25(D10) U14.25(DB10) ; port D10
D11: U11.26(DB11) U12.26(DB13) U13.26(D11) U14.26(DB11) ; port D11
D12: U11.27(DB12) U12.27(DB14) U13.27(D12) U14.27(DB12) ; port D12
D13: U11.28(DB13) U12.28(DB15) U13.28(D13) U14.28(DB13) ; port D13
D14: U11.29(DB14) U12.29(DB16) U13.29(D14) U14.29(DB14) ; port D14
D15: U11.30(DB15) U12.30(DB17) U13.30(D15) U14.30(DB15) ; port D15
DISP_RS: U11.8(RS) U12.8(RS) U13.8(DNC) U14.8(RS) ; port DISP_RS
N_DISP_CS: U11.7(/CS) U12.7(/CS) U13.7(/CS) U14.7(/CS) ; port N_DISP_CS
N_DISP_RD: U11.10(/RD) U12.10(/RD) U13.10(/RD) U14.10(/RD) ; port N_DISP_RD
N_DISP_RES: U11.31(/RESET) U12.31(/RESET) U13.31(/RESET) U14.31(/RESET) ; port N_DISP_RES
N_DISP_WR: U11.9(/WR) U12.9(/WR) U13.9(/WR) U14.9(/WR) ; port N_DISP_WR

### Notes on the sheet
- Mettre les 4 afficheurs en Monté/Non Monté avec config variantes :
- SC945-0x : avec afficheur Acrowise AWY-240320T28N05
- SC945-1x : avec afficheur 4D Systems 4DLCD28Q
- SC945-2x : avec afficheur Evervision VGG243264-7UFLWH
- SC945-3x : avec afficheur Formike KWH028Q20-F02-B
- Découplage proche de l'afficheur
- Pense-bete : relier la masse méca du support/afficheur au plan 0V de la carte !!
- Afficheur
- (in symbol Title_new) Sheet Size:; A3; Interface IHM; Print Date:; [No Variations]; Page:; /; EDA: ALtium Desingner 16; Rev. D

### Library data of the parts
C42 = C_0603_X5R_10%_4.7U-6.3V: Condensateur céramique, X5R, 10%, CMS 0603, 4.7uF/6.3V; Creation: FB (29/02/12); Boitier: 0603; Remarque: {Remarque}; Fabricant: Kemet; Ref Fab: C0603C475K9PAC; Coeff: 1; ComponentLink1URL: O:\_Documentation\Datasheets\Kemet\Condos_Ceramic_X5R.pdf; ComponentLink2URL: o:\_Documentation\Datasheets\_BOITIERS\PASSIF_CMS\; Config: *; ComponentLink1Description: Datasheet; ComponentLink2Description: Datasheet Boitier; Supplier 1: Farnell; Supplier 2: RadioSpares; Supplier Part Number 1: 9227784; Supplier Part Number 2: 6911164
C43 = C_0603_X7R_10%_100N-50V: Condensateur céramique, X7R, 10%, CMS 0603, 100nF/50V; Creation: FB (29/02/12); Boitier: 0603; Remarque: {Remarque}; Fabricant: Kemet; Ref Fab: C0603C104K5RAC; Coeff: 1; ComponentLink1URL: O:\_Documentation\Datasheets\Kemet\Condos_Ceramic_CMS.pdf; ComponentLink2URL: o:\_Documentation\Datasheets\_BOITIERS\PASSIF_CMS\; Config: *; ComponentLink1Description: Datasheet; ComponentLink2Description: Datasheet Boitier; Supplier 1: Farnell; Supplier Part Number 1: 1288255
R109 R111 = RES_0603_1%_100PPM_0R: Résistance, 0.100W, 1%, 100ppm, 75V, 0R; Creation: FB (04/07/12); Boitier: 0603; Remarque: {Remarque}; Fabricant: Vishay; Ref Fab: CRCW06030000Z0EA; Coeff: 1; Verification: *; ComponentLink1URL: O:\_Documentation\Datasheets\Vishay\Resistances_D-CRCWe3.pdf; ComponentLink2URL: o:\_Documentation\Datasheets\_BOITIERS\PASSIF_CMS\; Config: *; ComponentLink1Description: Datasheet; ComponentLink2Description: Datasheet Boitier; Supplier 1: Farnell; Supplier Part Number 1: 1469739
Title_new?#9 = Title_new
U11 = AFFICHEUR_AWY-240320T28N05: Afficheur tactile, TFT, taille 2.8p, 240x320p, bus CPU 16 bits, dale résistive 4 fils, backlight 4 Leds, nappe à souder 37pts pas 1mm; Creation: PDP (11/07/12); Boitier: 50x69.2_h2.5mm_FPC37_e1mm; Remarque: {Remarque}; Coeff: 1; Fabricant: Acrowise; ComponentLink1URL: O:\_Documentation\Datasheets\Acrowise\AWY-240320T28N05_datasheet.pdf; ComponentLink2URL: O:\_Documentation\Datasheets\Acrowise\AWY-240320T28N05_Plan coté.pdf; Config: *; ComponentLink1Description: Datasheet; ComponentLink2Description: Datasheet Boitier; Ref Fab: AWY-240320T28N05
U12 = AFFICHEUR_4DLCD28Q: Afficheur tactile, TFT, taille 2.8p, 240x320p, bus CPU 16 bits, dale résistive 4 fils, backlight 4 Leds, nappe à souder 37pts pas 1mm; Creation: FB (13/09/12); Boitier: 50x69.2_h4.1mm_FPC37_e1mm; Remarque: {Remarque}; Coeff: 1; Fabricant: 4D Systems; ComponentLink1URL: O:\_Documentation\Datasheets\4D_Systems\4DLCD28Q_datasheet.pdf; ComponentLink2URL: O:\_Documentation\Datasheets\4D_Systems\4DLCD28Q_Dimensions.pdf; Config: *; ComponentLink1Description: Datasheet; ComponentLink2Description: Datasheet Boitier; Ref Fab: 4DLCD28Q
U13 = AFFICHEUR_VGG243264-7UFLWH: Afficheur tactile, TFT, taille 2.8p, 240x320p, bus CPU 16 bits, dale résistive 4 fils, backlight 4 Leds, nappe à souder 37pts pas 1mm; Creation: FB (13/09/12); Boitier: 50x69.2_h4.2mm_FPC37_e1mm; Remarque: {Remarque}; Coeff: 1; Fabricant: Evervision; ComponentLink1URL: O:\_Documentation\Datasheets\Evervision\VGG243264-7UFLWH_datasheet.pdf; Config: *; ComponentLink1Description: Datasheet; ComponentLink2Description: Datasheet Boitier; Ref Fab: VGG243264-7UFLWH
U14 = AFFICHEUR_KWH028Q20_F02_B: Afficheur tactile, TFT, taille 2.8p, 240x320p, bus CPU 16 bits, dale résistive 4 fils, backlight 4 Leds, nappe à souder 37pts pas 1mm; Creation: ZA (30/07/13); Boitier: 50x69.2_h3.6mm_FPC37_e1mm; Remarque: Active area de  43.2x57.6mm; Coeff: 1; Fabricant: Formike Electronic; ComponentLink1URL: O:\_Documentation\Datasheets\Formike_Electronic\KWH028Q20-F02-B_datasheet.PDF; Config: *; ComponentLink1Description: Datasheet; ComponentLink2Description: Datasheet Boitier; Ref Fab: KWH028Q20-F02-B

## Nets that join several sheets
+3V15: SC945D_Interface_BP_et_Prog (5 pins), SC945D_Alimentations (7 pins), SC945D_Micro (18 pins), SC945D_SD_Card (C41.2 J3.4), SC945D_Afficheur (14 pins)
+5V: SC945D_Alimentations (5 pins), SC945D_Audio (C14.2 U6.6)
+6V5: SC945D_Interface_BP_et_Prog (D4.K), SC945D_Alimentations (14 pins), SC945D_Afficheur (U11.16 U12.16 U13.16 U14.16)
+15V: SC945D_Interface_BP_et_Prog (5 pins), SC945D_Alimentations (L2.1)
GND: SC945D_Interface_BP_et_Prog (22 pins), SC945D_Alimentations (20 pins), SC945D_Micro (20 pins), SC945D_SD_Card (C41.1 J3.6 J3.9 J3.9A), SC945D_Audio (8 pins), SC945D_Touchscreen (C1.1 C2.1 R1.1 R2.1), SC945D_Backlight (T1.2), SC945D_Afficheur (20 pins)
AFF_P12: SC945D_Touchscreen (R101.2 R103.2), SC945D_Afficheur (U11.12 U12.12 U13.12 U14.12)
AFF_P13: SC945D_Touchscreen (R105.2 R107.2), SC945D_Afficheur (U11.13 U12.13 U13.13 U14.13)
AFF_P14: SC945D_Touchscreen (R102.2 R104.2), SC945D_Afficheur (U11.14 U12.14 U13.14 U14.14)
AFF_P15: SC945D_Touchscreen (R106.2 R108.2), SC945D_Afficheur (U11.15 U12.15 U13.15 U14.15)
AFF_P17: SC945D_Backlight (R121.2 R122.2), SC945D_Afficheur (U11.17 U12.17 U13.17 U14.17)
AFF_P18: SC945D_Backlight (R123.2 R124.2), SC945D_Afficheur (U11.18 U12.18 U13.18 U14.18)
AFF_P19: SC945D_Backlight (R125.2 R126.2), SC945D_Afficheur (U11.19 U12.19 U13.19 U14.19)
AFF_P20: SC945D_Backlight (R127.2 R128.2), SC945D_Afficheur (U11.20 U12.20 U13.20 U14.20)
AUDIO_PWM: SC945D_Micro (U10.46), SC945D_Audio (JT1.1 R15.1)
CARD_DETECT: SC945D_Micro (R33.1 U10.64), SC945D_SD_Card (J3.10 J3.10A)
D0: SC945D_Micro (U10.16), SC945D_Afficheur (U11.1 U12.1 U13.1 U14.1)
D1: SC945D_Micro (U10.15), SC945D_Afficheur (U11.2 U12.2 U13.2 U14.2)
D2: SC945D_Micro (U10.14), SC945D_Afficheur (U11.3 U12.3 U13.3 U14.3)
D3: SC945D_Micro (U10.13), SC945D_Afficheur (U11.4 U12.4 U13.4 U14.4)
D4: SC945D_Micro (U10.12), SC945D_Afficheur (U11.22 U12.22 U13.22 U14.22)
D5: SC945D_Micro (U10.11), SC945D_Afficheur (U11.35 U12.35 U13.35 U14.35)
D6: SC945D_Micro (U10.17), SC945D_Afficheur (U11.36 U12.36 U13.36 U14.36)
D7: SC945D_Micro (U10.18), SC945D_Afficheur (U11.37 U12.37 U13.37 U14.37)
D8: SC945D_Micro (U10.21), SC945D_Afficheur (U11.23 U12.23 U13.23 U14.23)
D9: SC945D_Micro (U10.22), SC945D_Afficheur (U11.24 U12.24 U13.24 U14.24)
D10: SC945D_Micro (U10.23), SC945D_Afficheur (U11.25 U12.25 U13.25 U14.25)
D11: SC945D_Micro (U10.24), SC945D_Afficheur (U11.26 U12.26 U13.26 U14.26)
D12: SC945D_Micro (U10.27), SC945D_Afficheur (U11.27 U12.27 U13.27 U14.27)
D13: SC945D_Micro (U10.28), SC945D_Afficheur (U11.28 U12.28 U13.28 U14.28)
D14: SC945D_Micro (U10.29), SC945D_Afficheur (U11.29 U12.29 U13.29 U14.29)
D15: SC945D_Micro (U10.30), SC945D_Afficheur (U11.30 U12.30 U13.30 U14.30)
DCENB: SC945D_Micro (U10.49), SC945D_Backlight (JT25.1 R22.1)
DISP_RS: SC945D_Micro (U10.61), SC945D_Afficheur (U11.8 U12.8 U13.8 U14.8)
N_AUDIOENB: SC945D_Micro (U10.45), SC945D_Audio (R19.1)
N_DISP_CS: SC945D_Micro (U10.60), SC945D_Afficheur (U11.7 U12.7 U13.7 U14.7)
N_DISP_RD: SC945D_Micro (U10.59), SC945D_Afficheur (U11.10 U12.10 U13.10 U14.10)
N_DISP_RES: SC945D_Micro (U10.35), SC945D_Afficheur (U11.31 U12.31 U13.31 U14.31)
N_DISP_WR: SC945D_Micro (U10.58), SC945D_Afficheur (U11.9 U12.9 U13.9 U14.9)
N_RESET: SC945D_Interface_BP_et_Prog (JT8.1 R23.1), SC945D_Alimentations (U4.1), SC945D_Micro (R32.1 U10.7)
N_SDCS: SC945D_Micro (U10.8), SC945D_SD_Card (J3.2 JT12.1)
RX_0: SC945D_Interface_BP_et_Prog (5 pins), SC945D_Micro (R11.1 U10.34)
SCK: SC945D_Micro (U10.4), SC945D_SD_Card (J3.5 JT14.1)
SDI: SC945D_Micro (U10.5), SC945D_SD_Card (J3.7 JT15.1)
SDO: SC945D_Micro (U10.6), SC945D_SD_Card (J3.3 JT13.1)
TX_0: SC945D_Interface_BP_et_Prog (JT10.1 R28.1 U9.6), SC945D_Micro (U10.33)
UC_XL_X-: SC945D_Micro (U10.47), SC945D_Touchscreen (R103.1 R104.1)
UC_XR_X+: SC945D_Micro (U10.2), SC945D_Touchscreen (C1.2 R1.2 R101.1 R102.1)
UC_YD_Y-: SC945D_Micro (U10.48), SC945D_Touchscreen (R107.1 R108.1)
UC_YU_Y+: SC945D_Micro (U10.3), SC945D_Touchscreen (C2.2 R2.2 R105.1 R106.1)

## Assembly variants
SC945-0C: not fitted C1 C2 C18 C46 R11 R18 R21 R102 R103 R105 R108 R122 R124 R126 R128 U12 U13 U14
SC945-1C: not fitted C1 C2 C18 C46 R11 R18 R21 R102 R103 R106 R107 R122 R124 R126 R128 U11 U13 U14
SC945-2C: not fitted C1 C2 C18 C46 R18 R21 R101 R104 R106 R107 R121 R123 R125 R127 U11 U12 U14
SC945-3C: not fitted C1 C2 C18 C46 R11 R18 R21 R102 R103 R106 R107 R122 R124 R126 R128 U11 U12 U13